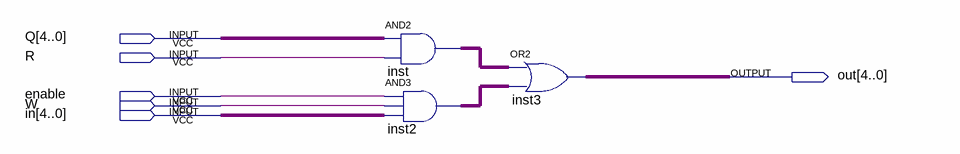
[diagram p0: schematic sheet]
// Quartus schematic controladorRAM.bdf as structural Verilog: 3 symbols, 6 pins
module controladorRAM (
  input  [4:0] Q,
  input  R,
  input  enable,
  input  W,
  input  [4:0] in,
  output [4:0] out
);

  wire [4:0] inst2_out, inst_out;

  assign inst_out = Q & {5{R}};  // AND2 inst, 5 bits wide
  assign inst2_out = {5{enable}} & {5{W}} & in;  // AND3 inst2, 5 bits wide
  assign out = inst_out | inst2_out;  // OR2 inst3, 5 bits wide
endmodule
